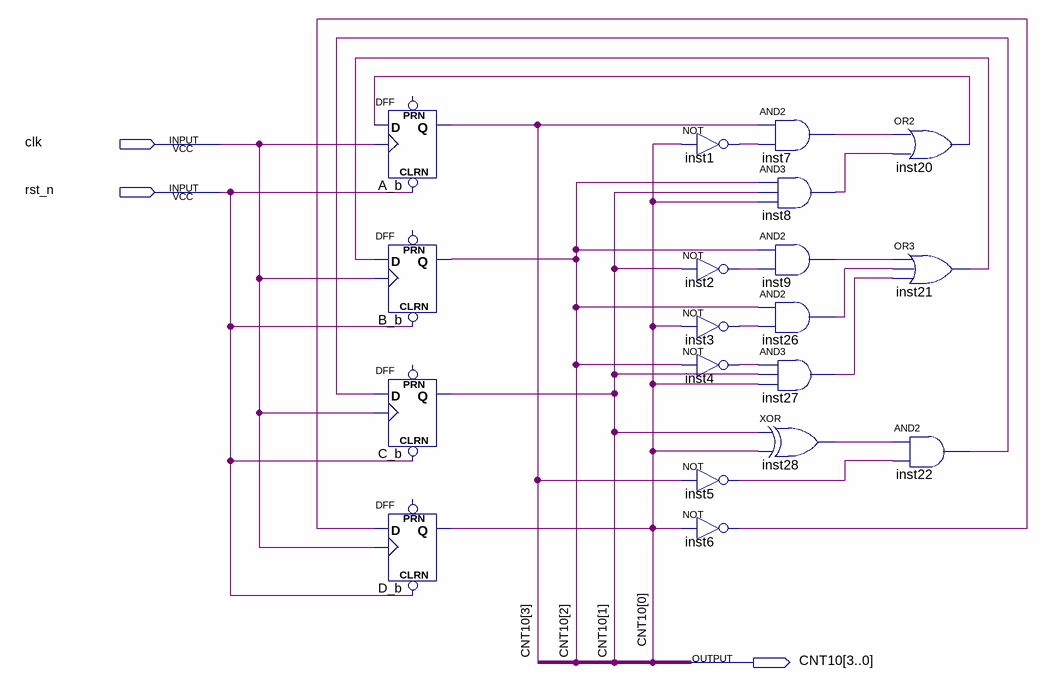
[diagram p0: schematic sheet]
// Quartus schematic decimal_counter.bdf as structural Verilog: 19 symbols, 3 pins
module decimal_counter (
  input  clk,
  input  rst_n,
  output [3:0] CNT10
);

  wire inst1_out, inst2_out, inst3_out, inst4_out, inst5_out, inst6_out, inst7_out, inst8_out, inst9_out,
       inst20_out, inst21_out, inst22_out, inst26_out, inst27_out, inst28_out;

  DFF A_b (.CLRN(rst_n), .CLK(clk), .D(inst20_out), .Q(CNT10[3]));  // open: PRN
  DFF B_b (.CLRN(rst_n), .CLK(clk), .D(inst21_out), .Q(CNT10[2]));  // open: PRN
  DFF C_b (.CLRN(rst_n), .CLK(clk), .D(inst22_out), .Q(CNT10[1]));  // open: PRN
  DFF D_b (.CLRN(rst_n), .CLK(clk), .D(inst6_out), .Q(CNT10[0]));  // open: PRN
  not inst1 (inst1_out, CNT10[0]);
  not inst2 (inst2_out, CNT10[1]);
  not inst3 (inst3_out, CNT10[0]);
  not inst4 (inst4_out, CNT10[2]);
  not inst5 (inst5_out, CNT10[3]);
  not inst6 (inst6_out, CNT10[0]);
  and inst7 (inst7_out, CNT10[3], inst1_out);
  and inst8 (inst8_out, CNT10[2], CNT10[1], CNT10[0]);
  and inst9 (inst9_out, CNT10[2], inst2_out);
  and inst26 (inst26_out, CNT10[2], inst3_out);
  and inst27 (inst27_out, inst4_out, CNT10[1], CNT10[0]);
  xor inst28 (inst28_out, CNT10[1], CNT10[0]);
  or inst20 (inst20_out, inst7_out, inst8_out);
  or inst21 (inst21_out, inst9_out, inst26_out, inst27_out);
  and inst22 (inst22_out, inst28_out, inst5_out);
endmodule
